# EAGLE board snc98_Display_15x7-Seg_1-digit_SC39 (EAGLE 6.6.0), part 1 of 3
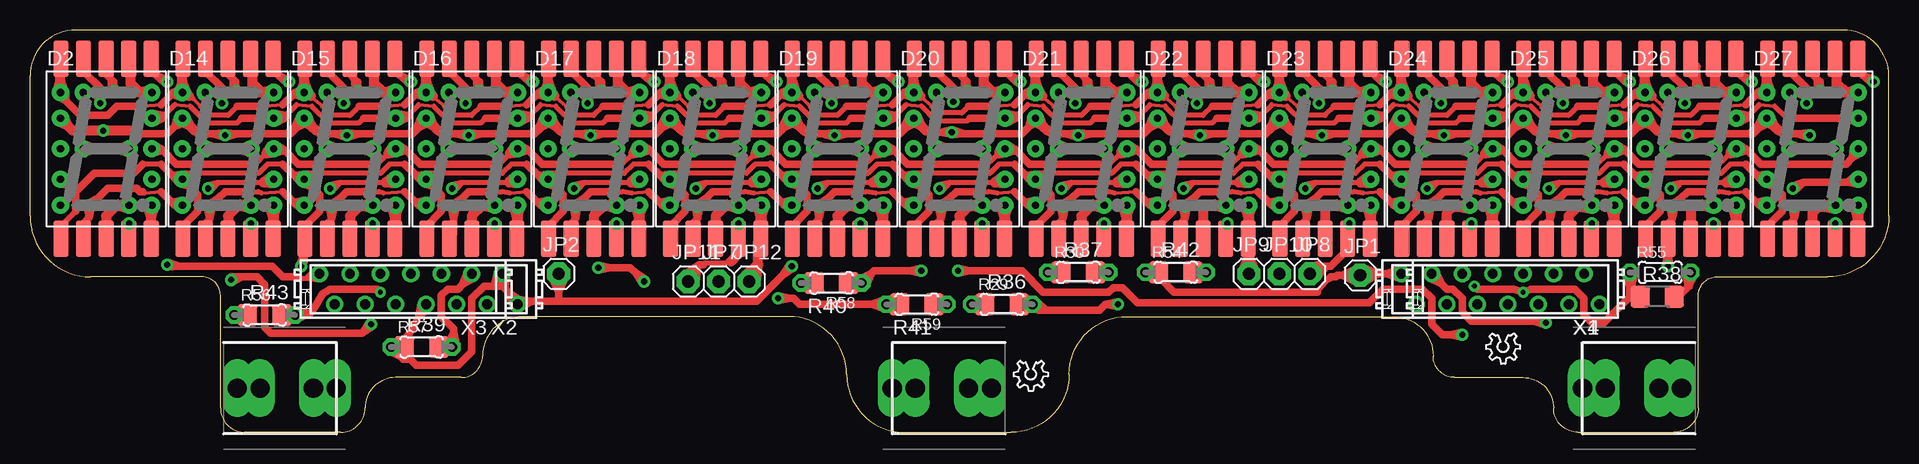
[diagram p2: board, top side]
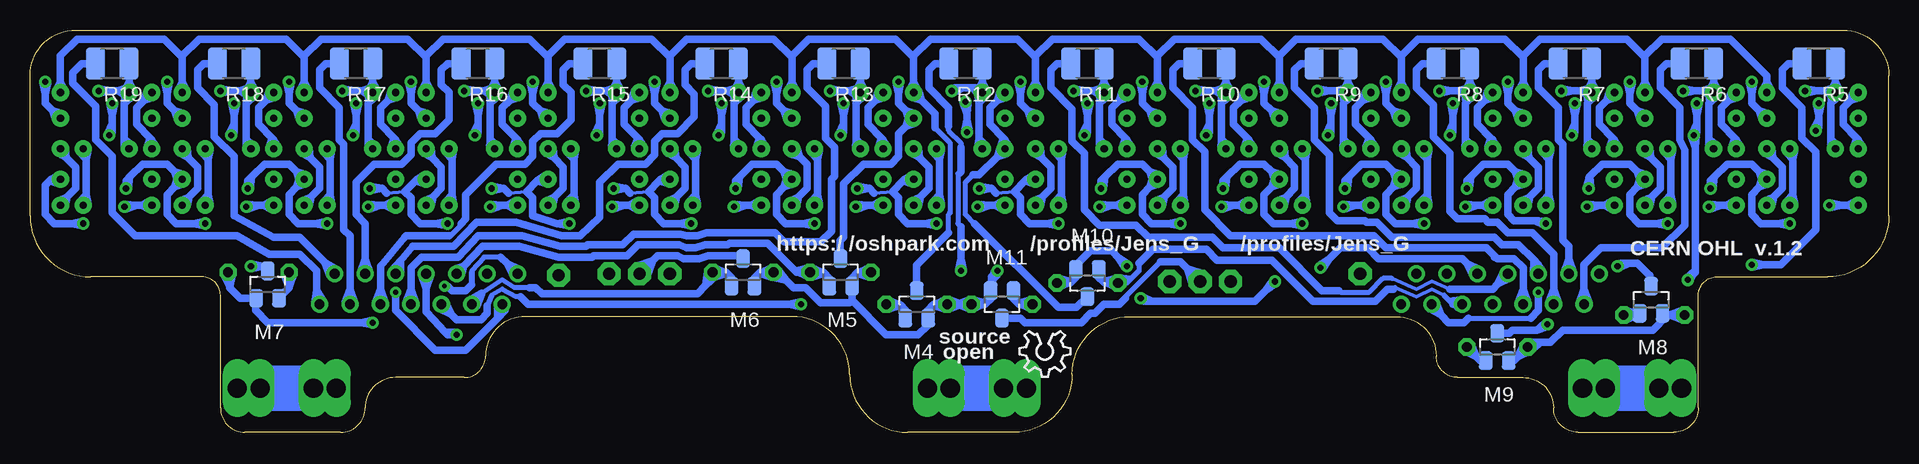
[diagram p3: board, bottom side, seen from below]

Size 154.94 x 33.53 mm. Coordinates in mm from the lower left corner, seen from the top.
Outline: 154.94,29.72 arc90 151.13,33.53 3.81,33.53 arc90 0,29.72 0,18.03 arc90 5.08,12.95 14.35,12.95 arc-90 15.88,11.43 15.88,2.03 arc90 17.91,0 25.91,0 arc90 27.94,2.03 arc-90 30.48,4.57 35.94,4.57 arc90 37.72,6.35 arc-90 41.02,9.65 63.25,9.65 arc-90 68.07,4.83 arc90 72.9,0 81.79,0 arc90 86.61,4.83 arc-90 91.44,9.65 113.67,9.65 arc-90 116.97,6.35 arc90 118.75,4.57 124.46,4.57 arc-90 127,2.03 arc90 129.03,0 137.03,0 arc90 139.06,2.03 139.06,11.43 arc-90 140.59,12.95 149.86,12.95 arc90 154.94,18.03 154.94,29.72
Copper layers (1*16): Top 0.035mm / dielectric 1.5mm / Bottom 0.035mm
Design rules "OSHPark-8mil-2layer": minimum track width 10mil, minimum drill 15mil, track to track 8mil, track to pad 8mil, pad to pad 8mil, via to via 8mil, smd to smd 8mil, copper to edge 8mil, drill to drill 8mil, minimum pad ring 12mil, minimum via ring 10mil, stop-mask expansion 4mil, vias tented up to drill 20mil, thermal gap 10mil

## Footprints (pad centres in the part's own frame; a part is rotated, then mirrored left to right if it is on the bottom)
BATTERY-AAA-LEFT = drill 1.6 long: P1 -2.413,0; P2 3.937,0; P3 2.032,0; P4 -4.318,0
BATTERY-AAA-RIGHT = drill 1.6 long: M1 -3.937,0; M2 2.413,0; M3 4.318,0; M4 -2.032,0
10MM_UNI = drill 0.6 pad 1.422: 1 -3.81,4.699; 2 -3.81,2.54; 3 -3.81,0; 4 -3.81,-2.54; 5 -3.81,-4.699; 6 3.81,-4.699; 7 3.81,-2.54; 8 3.81,0; 9 3.81,2.54; 10 3.81,4.699; 11 -1.905,4.699; 12 -1.905,0; 13 1.905,0; 14 1.905,-4.699 | smd 1.27 x 3.048: 21 -3.76,-7.5; 22 -1.88,-7.5; 23 0,-7.5; 24 1.88,-7.5; 25 3.76,-7.5; 26 3.76,7.5; 27 1.88,7.5; 28 0,7.5; 29 -1.88,7.5; 30 -3.76,7.5
1X01 = drill 1.016 pad 1.93 octagon: 1 0,0
SOT-23 = smd 1.143 x 1.524: 1 0.953,1.143; 2 -0.953,1.143; 3 0,-1.143
R1210 = smd 1.6 x 2.7: 1 -1.4,0; 2 1.4,0
0204/5 = drill 0.813 octagon: 1 -2.54,0; 2 2.54,0
R1206 = smd 1.6 x 1.803: 1 -1.422,0; 2 1.422,0
MICROMATCH-12 = drill 0.813: 1 6.985,-1.27; 2 5.715,1.27; 3 4.445,-1.27; 4 3.175,1.27; 5 1.905,-1.27; 6 0.635,1.27; 7 -0.635,-1.27; 8 -1.905,1.27; 9 -3.175,-1.27; 10 -4.445,1.27; 11 -5.715,-1.27; 12 -6.985,1.27
MICROMATCH-14 = drill 0.813: 1 8.255,-1.27; 2 6.985,1.27; 3 5.715,-1.27; 4 4.445,1.27; 5 3.175,-1.27; 6 1.905,1.27; 7 0.635,-1.27; 8 -0.635,1.27; 9 -1.905,-1.27; 10 -3.175,1.27; 11 -4.445,-1.27; 12 -5.715,1.27; 13 -6.985,-1.27; 14 -8.255,1.27

## Placement (x,y rotation side)
BH4  HOLDER_AAA_LEFT1  [BATTERY-AAA-LEFT]  133.73,3.68 0 top
BH5  HOLDER_AAA_LEFT1  [BATTERY-AAA-LEFT]  76.2,3.68 0 top
BH6  HOLDER_AAA_RIGHT  [BATTERY-AAA-RIGHT]  21.21,3.68 0 top
D2  SC40-11_UNISC40-11_UNI  [10MM_UNI]  6.35,23.62 0 top
D14  SC40-11_UNISC40-11_UNI  [10MM_UNI]  16.51,23.62 0 top
D15  SC40-11_UNISC40-11_UNI  [10MM_UNI]  26.67,23.62 0 top
D16  SC40-11_UNISC40-11_UNI  [10MM_UNI]  36.83,23.62 0 top
D17  SC40-11_UNISC40-11_UNI  [10MM_UNI]  46.99,23.62 0 top
D18  SC40-11_UNISC40-11_UNI  [10MM_UNI]  57.15,23.62 0 top
D19  SC40-11_UNISC40-11_UNI  [10MM_UNI]  67.31,23.62 0 top
D20  SC40-11_UNISC40-11_UNI  [10MM_UNI]  77.47,23.62 0 top
D21  SC40-11_UNISC40-11_UNI  [10MM_UNI]  87.63,23.62 0 top
D22  SC40-11_UNISC40-11_UNI  [10MM_UNI]  97.79,23.62 0 top
D23  SC40-11_UNISC40-11_UNI  [10MM_UNI]  107.95,23.62 0 top
D24  SC40-11_UNISC40-11_UNI  [10MM_UNI]  118.11,23.62 0 top
D25  SC40-11_UNISC40-11_UNI  [10MM_UNI]  128.27,23.62 0 top
D26  SC40-11_UNISC40-11_UNI  [10MM_UNI]  138.43,23.62 0 top
D27  SC40-11_UNISC40-11_UNI  [10MM_UNI]  148.59,23.62 0 top
JP1  [1X01]  110.87,13.08 0 top
JP2  [1X01]  44.07,13.21 0 top
JP7  [1X01]  57.4,12.57 0 top
JP8  [1X01]  106.68,13.21 0 top
JP9  [1X01]  101.6,13.21 0 top
JP10  [1X01]  104.14,13.21 0 top
JP11  [1X01]  54.86,12.57 0 top
JP12  [1X01]  59.94,12.57 0 top
LOGO1  OSHW_LOGO_8MILX0150-NT  [OSHW_8X150_NOTEXT]  68.22,8.43 180 bottom
LOGO2  OSHW_LOGO_6MILX0100-NT  [OSHW_6X100_NOTEXT]  84.84,5.97 180 top
LOGO3  OSHW_LOGO_6MILX0100-NT  [OSHW_6X100_NOTEXT]  124.21,8.26 180 top
M4  IRLML2244  [SOT-23]  81.03,10.67 180 bottom
M5  IRLML2244  [SOT-23]  87.38,13.34 180 bottom
M6  IRLML2244  [SOT-23]  95.5,13.34 180 bottom
M7  IRLML2244  [SOT-23]  135.13,12.32 180 bottom
M8  IRLML2244  [SOT-23]  19.81,11.05 180 bottom
M9  IRLML2244  [SOT-23]  32.64,7.11 180 bottom
M10  IRLML2244  [SOT-23]  66.8,12.45 0 bottom
M11  IRLML2244  [SOT-23]  73.91,10.67 0 bottom
R5  22  [R1210]  5.84,30.73 180 bottom
R6  22  [R1210]  16,30.73 180 bottom
R7  22  [R1210]  26.16,30.73 180 bottom
R8  22  [R1210]  36.32,30.73 180 bottom
R9  22  [R1210]  46.48,30.73 180 bottom
R10  22  [R1210]  56.64,30.73 180 bottom
R11  22  [R1210]  66.8,30.73 180 bottom
R12  22  [R1210]  76.96,30.73 180 bottom
R13  22  [R1210]  87.12,30.73 180 bottom
R14  22  [R1210]  97.28,30.73 180 bottom
R15  22  [R1210]  107.44,30.73 180 bottom
R16  22  [R1210]  117.6,30.73 180 bottom
R17  22  [R1210]  127.76,30.73 180 bottom
R18  22  [R1210]  137.92,30.73 180 bottom
R19  22  [R1210]  148.08,30.73 180 bottom
R29  3k3  [0204/5]  81.03,10.67 0 top
R30  3k3  [0204/5]  87.38,13.34 0 top
R36  3k3  [R1206]  81.03,10.67 0 top
R37  3k3  [R1206]  87.38,13.34 0 top
R38  3k3  [R1206]  135.64,11.3 0 top
R39  3k3  [R1206]  32.64,7.11 0 top
R40  3k3  [R1206]  66.8,12.45 180 top
R41  3k3  [R1206]  73.91,10.67 180 top
R42  3k3  [R1206]  95.5,13.34 0 top
R43  3k3  [R1206]  19.56,9.78 0 top
R54  3k3  [0204/5]  95.5,13.34 0 top
R55  3k3  [0204/5]  135.89,13.34 0 top
R56  3k3  [0204/5]  19.56,9.78 0 top
R57  3k3  [0204/5]  32.64,7.11 0 top
R58  3k3  [0204/5]  66.8,12.45 180 top
R59  3k3  [0204/5]  73.91,10.67 180 top
X1  MICROMATCH-12  [MICROMATCH-12]  123.83,11.94 180 top
X2  MICROMATCH-14  [MICROMATCH-14]  32.38,11.94 180 top
X3  MICROMATCH-12  [MICROMATCH-12]  31.11,11.94 180 top
X4  MICROMATCH-14  [MICROMATCH-14]  122.56,11.94 180 top

## Tracks (layer width: path | path; a pad name or v marks a point on that pad's centre or on a via)
CA_LED  (via drill 0.41, 0.51)
  Top 0.254: 31.92,8.79 31.75,8.89 31.75,7.62 31.32,7.21 R39.1
  Top 0.406: 36.2,6.22 36.2,6.1 | 108.33,12.83 107.31,11.81 107.31,11.68
  Top 0.508: 31.32,7.21 30.24,7.55 R57.1 30.3,6.7 31.32,7.21
  Top 0.61: R43.1 R56.1 | 43.81,10.92 60.58,10.92 62.78,13.12 | 43.81,10.92 42.67,10.92 | 42.67,10.92 41.83,10.92 | 41.83,10.92 40.64,10.92 | 62.78,13.12 v63.5,13.84 | R36.1 R29.1 | R37.1 85.95,13.36 85.85,13.46 84.96,13.46 R30.1 | R54.1 93.7,13.31 R42.1 94.18,13.24 | 107.31,11.68 95.36,11.68 94.25,12.79 94.25,13.17 94.18,13.24 | 40.64,10.92 39.91,11.65 | 39.91,11.65 39.56,12 | 39.56,12 39.37,12.19 | 39.37,12.19 38.7,12.19 | 38.7,12.19 37.85,12.19 36.83,11.18 36.83,6.73 36.2,6.1 35.69,5.59 32.21,5.59 31.7,6.1 31.11,6.1 30.96,6.25 | X2.8 32.41,9.62 | 32.41,9.62 31.92,8.79 31.24,7.62 31.24,7.54 | 31.24,7.54 31.24,7.14 | X4.1 113.08,13.21 | 113.08,13.21 112.39,13.21 | 112.39,13.21 110.24,13.21 JP1.1 | JP1.1 109.35,13.08 | 109.35,13.08 108.97,13.08 108.84,12.95 108.46,12.95 108.33,12.83 | X2.13 39.37,12.19 | 42.55,10.79 42.67,10.92 | JP2.1 44.07,11.68 | 44.07,11.68 44.07,11.18 43.81,10.92 | R58.1 R40.1 | R58.1 68.76,12.45 | 31.7,6.63 31.31,7.01 | 31.31,7.01 R39.1 | 31.11,7.21 R39.1 | R41.1 R59.1 | v74.3,13.46 73.28,13.46 | 73.28,13.46 70.36,13.46 70.2,13.31 | 70.2,13.31 R58.1 | R39.1 R57.1 | 30.96,6.25 R57.1 | R38.1 134.21,11.33 133.48,12.06 133.48,12.12 | 133.48,12.12 133.48,13.21 R55.1 | R55.1 133.35,12.12 | 133.35,12.12 133.35,11.3 131.19,9.14 130.18,9.14 129.54,9.78 129.54,11.18 128.78,11.94 125.09,11.94 v124.46,11.68 123.7,11.94 120.65,11.94 v120.4,12.19 | X2.14 40.64,10.92 | 62.78,13.12 63.61,13.67 v63.5,13.84 | 62.78,13.12 63.33,13.96 v63.5,13.84 | 73.28,13.46 74.25,13.26 v74.3,13.46 | 73.28,13.46 74.25,13.66 v74.3,13.46 | 94.18,13.24 93.13,13.71 R54.1 | 94.18,13.24 93.07,12.94 R54.1 | 133.48,12.12 133.75,13.24 R55.1 | 133.48,12.12 132.98,13.16 R55.1
  Top 0.61: 133.35,12.12 133.73,13.2 R55.1 | 133.35,12.12 132.97,13.2 R55.1 | 32.41,9.62 33.28,10.36 X2.8 | 32.41,9.62 32.62,10.74 X2.8 | 113.08,13.21 114.17,12.82 X4.1 | 113.08,13.21 114.17,13.59 X4.1 | 41.83,10.92 40.69,11.07 X2.14 | 41.83,10.92 40.85,10.32 X2.14 | 39.91,11.65 40.25,10.55 X2.14 | 39.91,11.65 40.87,11.01 X2.14 | 39.56,12 39.77,13.13 X2.13 | 39.56,12 39.01,13.02 X2.13 | 38.7,12.19 39.61,12.88 X2.13 | 38.7,12.19 38.98,13.31 X2.13 | 112.39,13.21 111.11,13.7 JP1.1 | 112.39,13.21 111.21,12.51 JP1.1 | 109.35,13.08 110.58,12.49 JP1.1 | 109.35,13.08 110.58,13.68 JP1.1 | 44.07,11.68 44.66,12.92 JP2.1 | 44.07,11.68 43.47,12.92 JP2.1 | 31.24,7.54 30.09,7.52 R57.1 | 31.24,7.54 30.36,6.8 R57.1 | 31.31,7.01 30.27,7.48 R57.1 | 31.31,7.01 30.2,6.72 R57.1 | 30.96,6.25 30.47,7.29 R57.1 | 30.96,6.25 29.92,6.75 R57.1 | 70.2,13.31 69.17,12.81 R58.1 | 70.2,13.31 69.71,12.27 R58.1
  Bottom 0.406: 118.11,13.34 118.11,13.46 117.09,14.61 115.7,14.61
  Bottom 0.508: 118.11,13.34 118.11,12.32
  Bottom 0.61: 28.94,7.49 28.19,7.49 27.18,8.51 19.68,8.51 18.49,9.7 M8.2 18.75,9.78 18.24,9.78 | 28.94,7.49 29.72,7.49 R57.1 | 64.22,14.56 64.77,15.11 66.55,15.11 67.74,13.92 M10.2 67.74,12.93 68.13,12.54 | 64.22,14.56 v63.5,13.84 | 18.24,9.78 R56.1 | 79.7,10.57 80.09,10.19 M4.2 80.14,9.6 80.14,8.89 80.9,8.13 83.57,8.13 86.44,11 | 79.7,10.57 R36.1 R29.1 | 86.05,13.24 86.44,12.85 M5.2 86.44,12.31 86.44,11 | 86.05,13.24 R37.1 R30.1 | 86.44,11 86.64,10.79 89.03,10.79 90.3,12.06 91.31,12.06 91.93,12.69 | R54.1 92.58,13.34 91.93,12.69 | v120.4,12.19 120.14,12.19 119.76,11.81 118.62,11.81 118.11,12.32 | R58.1 68.33,12.45 | M9.2 31.24,5.97 30.96,6.25 | 30.96,6.25 R57.1 | 68.13,12.54 R40.1 R58.1 | 75.24,10.77 74.85,11.15 M11.2 74.8,11.73 74.8,12.58 | 75.24,10.77 R41.1 R59.1 | 74.8,12.58 74.8,12.95 v74.3,13.46 | R59.1 77.27,10.67 | 77.27,10.67 77.67,10.67 | 77.67,10.67 R29.1 | X4.2 115.32,10.16 115.96,9.51 | M7.2 R38.1 134.21,11.33 133.6,11.81 | 133.6,11.81 133.35,12.06 133.35,12.12 | 133.35,12.12 R55.1 | 133.6,11.81 134.11,11.3 134.24,11.3 | 115.96,9.51 118.62,6.86 121.16,6.86 124.46,10.16 v124.46,11.68 | M6.2 94.55,12.87 94.18,13.24 | 94.18,13.24 R42.1 R54.1 | X4.1 115.16,14.07 | 115.16,14.07 115.7,14.61 | 64.22,14.56 63.39,14.01 v63.5,13.84 | 64.22,14.56 63.67,13.73 v63.5,13.84 | 74.8,12.58 74.49,13.53 v74.3,13.46 | 74.8,12.58 74.14,13.33 v74.3,13.46 | 79.7,10.57 78.65,11.04 R29.1 | 79.7,10.57 78.59,10.28 R29.1 | 77.27,10.67 78.35,10.29 R29.1 | 77.27,10.67 78.35,11.05 R29.1 | 86.05,13.24 85,13.71 R30.1 | 86.05,13.24 84.94,12.94 R30.1 | 91.93,12.69 93.05,12.94 R54.1 | 91.93,12.69 92.64,13.59 R54.1 | 94.18,13.24 93.13,13.71 R54.1
  Bottom 0.61: 94.18,13.24 93.07,12.94 R54.1 | 133.35,12.12 133.73,13.2 R55.1 | 133.35,12.12 132.97,13.2 R55.1 | 18.24,9.78 17.15,10.16 R56.1 | 18.24,9.78 17.15,9.4 R56.1 | 115.16,14.07 114.12,13.57 X4.1 | 115.16,14.07 114.67,13.03 X4.1 | 115.96,9.51 115.98,10.66 X4.2 | 115.96,9.51 115.25,10.42 X4.2 | 28.94,7.49 29.85,6.79 R57.1 | 28.94,7.49 30.09,7.52 R57.1 | 30.96,6.25 30.47,7.29 R57.1 | 30.96,6.25 29.92,6.75 R57.1 | 68.13,12.54 69.18,12.07 R58.1 | 68.13,12.54 69.24,12.84 R58.1 | 75.24,10.77 76.29,10.3 R59.1 | 75.24,10.77 76.35,11.06 R59.1 | 77.67,10.67 76.59,11.05 R59.1 | 77.67,10.67 76.59,10.29 R59.1
D0_A  (via drill 0.51)
  Top 0.406: 22.1,12.95 22.23,12.95 22.35,12.83 22.97,12.83 | 22.97,12.83 23.88,12.83 24,12.95 | 22.97,12.83 24.07,12.7 X2.1 23.79,13.58 22.97,12.83
  Top 0.61: 12.44,13.84 20.19,13.84 21.08,12.95 22.1,12.95 | 12.44,13.84 11.56,13.84 v11.43,13.97 | X2.1 24.26,13.21 24,12.95 | 12.44,13.84 11.49,14.16 v11.43,13.97 | 12.44,13.84 11.45,13.77 v11.43,13.97
  Bottom 0.61: v11.43,13.97 10.41,13.97 | 10.41,13.97 9.02,13.97 6.1,16.89 6.1,23.37 7.24,24.51 7.24,27.05 8.89,28.7 8.89,30.23 8.38,30.73 R5.2 | 10.41,13.97 11.39,13.77 v11.43,13.97 | 10.41,13.97 11.39,14.17 v11.43,13.97
D1_A
  Bottom 0.61: R6.2 18.54,30.73 19.05,30.23 19.05,28.7 17.4,27.05 17.4,24.38 17.02,23.5 17.02,17.27 18.92,15.37 24,15.37 25.4,13.97 25.4,11.89 | 25.4,11.89 X2.2 | 25.4,11.89 25.02,10.8 X2.2 | 25.4,11.89 25.78,10.8 X2.2
D2_A
  Bottom 0.61: X2.3 26.67,14.43 | 26.67,14.43 26.67,15.49 27.18,16 27.18,24 27.56,24.38 27.56,27.05 29.21,28.7 29.21,30.23 28.7,30.73 R7.2 | 26.67,14.43 26.29,13.34 X2.3 | 26.67,14.43 27.05,13.34 X2.3
D3_A
  Bottom 0.61: R8.2 38.86,30.73 39.37,30.23 39.37,28.7 37.97,27.3 37.97,24.64 36.58,23.24 36.58,18.41 35.94,17.78 33.66,17.78 33.4,17.53 32.64,17.53 31.75,16.64 29.72,16.64 27.94,14.86 27.94,11.89 | 27.94,11.89 X2.4 | 27.94,11.89 27.56,10.8 X2.4 | 27.94,11.89 28.32,10.8 X2.4
D4_A
  Bottom 0.61: 29.6,14.36 29.21,13.97 X2.5 | 29.6,14.36 30.86,15.62 32.26,15.62 32.89,16.26 41.4,16.26 42.67,17.53 43.56,17.53 43.69,17.65 45.97,17.65 46.61,18.29 46.61,23.11 47.88,24.38 47.88,27.05 49.53,28.7 49.53,30.23 49.02,30.73 R9.2 | 29.6,14.36 28.89,13.46 X2.5 | 29.6,14.36 29.62,13.21 X2.5
D5_A
  Bottom 0.61: R10.2 59.18,30.73 59.69,30.23 59.69,28.7 58.04,27.05 58.04,24.38 57.02,23.37 57.02,18.54 54.86,16.38 42.93,16.38 41.91,15.37 33.53,15.37 32.77,14.61 | 32.89,14.61 32.77,14.61 | 30.48,11.89 30.48,13.72 31.24,14.48 32.64,14.48 32.77,14.61 | 30.48,11.89 X2.6 | 30.48,11.89 30.1,10.8 X2.6 | 30.48,11.89 30.86,10.8 X2.6
D6_A
  Bottom 0.305: 36.58,11.94 38.1,12.57 39.37,11.94 41.4,12.83
  Bottom 0.406: 41.4,12.83 42.16,12.83 43.31,11.68 45.72,11.68 45.85,11.81
  Bottom 0.61: 45.85,11.81 47.24,11.81 50.8,15.37 55.5,15.37 56.39,16.26 61.72,16.26 62.74,17.27 65.79,17.27 67.06,18.54 67.06,23.24 68.07,24.26 68.07,26.92 69.85,28.7 69.85,30.23 69.34,30.73 R11.2 | 36.58,11.94 33.02,11.94 32.61,12.35 | 32.61,12.35 X2.7 | 32.61,12.35 32.12,13.38 X2.7 | 32.61,12.35 31.57,12.84 X2.7
D7_A  (via drill 0.51)
  Top 0.61: v77.34,13.46 78.36,13.46 | 78.36,13.46 82.68,13.46 84.45,11.68 89.92,11.68 90.3,12.06 91.06,12.06 92.33,10.79 111.63,10.79 112.78,11.94 116.08,11.94 116.84,11.18 116.84,9.02 117.73,8.13 118.36,8.13 | v119.38,8.13 118.36,8.13 | 78.36,13.46 77.38,13.66 v77.34,13.46 | 78.36,13.46 77.38,13.26 v77.34,13.46 | 118.36,8.13 119.34,7.93 v119.38,8.13 | 118.36,8.13 119.34,8.33 v119.38,8.13
  Bottom 0.406: 77.34,21.72 77.34,21.59 77.47,21.46 77.6,21.59 77.6,17.4 77.34,17.14 | 77.34,23.75 77.34,24.13 78.36,25.15 78.36,25.52
  Bottom 0.61: 77.34,17.14 77.34,14.48 | 77.34,14.48 v77.34,13.46 | R12.2 79.5,30.73 80.01,30.23 80.01,28.7 78.36,27.05 78.36,25.53 78.36,25.52 | 77.34,21.72 77.34,23.75 | 120.36,8.38 121.28,9.4 121.92,10.03 121.92,11.99 | 120.36,8.38 120.14,8.13 v119.38,8.13 | X4.7 121.92,11.99 | 77.34,14.48 77.14,13.5 v77.34,13.46 | 77.34,14.48 77.54,13.5 v77.34,13.46 | 120.36,8.38 119.37,8.33 v119.38,8.13 | 120.36,8.38 119.47,7.95 v119.38,8.13 | 121.92,11.99 122.3,13.07 X4.7 | 121.92,11.99 121.54,13.07 X4.7
D8_A
  Bottom 0.61: R13.2 89.66,30.73 90.17,30.23 90.17,28.7 88.65,27.18 88.65,24.51 87.88,23.75 87.88,21.34 88.14,21.08 88.14,16.76 89.03,15.88 92.08,15.88 92.84,16.64 98.55,16.64 99.31,16.38 100.2,16.38 100.71,16.51 104.65,16.51 105.54,15.62 108.46,15.62 108.58,15.49 110.74,15.49 113.92,16.38 117.6,16.38 119.25,14.61 122.3,14.61 123.19,13.72 123.19,11.89 | 123.19,11.89 X4.8 | 123.19,11.89 122.81,10.8 X4.8 | 123.19,11.89 123.57,10.8 X4.8
D9_A
  Bottom 0.61: 124.05,14.3 124.21,13.97 X4.9 | 124.05,14.3 123.06,15.49 119.63,15.49 117.73,17.53 114.43,17.53 110.62,16.38 109.09,16.38 107.44,17.91 107.44,20.83 105.92,22.35 103.63,22.35 102.87,23.11 102.87,24.26 102.23,24.89 100.97,24.89 99.57,26.29 99.57,28.19 100.33,28.96 100.33,30.23 99.82,30.73 R14.2 | 124.05,14.3 124.06,13.16 X4.9 | 124.05,14.3 124.75,13.5 X4.9
D10_A
  Bottom 0.406: 120.02,16.38 119.89,16.38 119,17.27 119,17.4
  Bottom 0.61: 119,17.4 118.62,17.78 118.62,19.81 116.08,22.35 113.67,22.35 113.03,22.99 113.03,24.26 112.39,24.89 111,24.89 109.86,26.04 109.86,28.32 110.49,28.96 110.49,30.23 109.98,30.73 R15.2 | X4.10 125.73,11.89 | 125.73,11.89 125.73,13.84 123.7,16.26 123.57,16.38 120.02,16.38 | 125.73,11.89 125.35,10.8 X4.10 | 125.73,11.89 126.11,10.8 X4.10
D11_A
  Bottom 0.61: R16.2 120.14,30.73 120.65,30.23 120.65,28.96 120.02,28.32 120.02,26.04 121.16,24.89 122.43,24.89 123.19,24.13 123.19,23.11 123.95,22.35 126.24,22.35 127.76,20.83 127.76,18.16 127,17.4 127,14.43 | X4.11 127,14.43 | 127,14.43 126.62,13.34 X4.11 | 127,14.43 127.38,13.34 X4.11
D12_A
  Bottom 0.61: 129.29,30.61 R17.2 130.3,30.73 130.81,30.23 130.81,28.7 129.16,27.05 129.16,24.38 128.78,24 128.78,16.89 128.27,16.38 128.27,11.89 | X4.12 128.27,11.89 | 128.27,11.89 127.89,10.8 X4.12 | 128.27,11.89 128.65,10.8 X4.12
D13_A
  Bottom 0.61: R18.2 140.46,30.73 140.97,30.23 140.97,28.7 139.57,27.3 139.57,24.64 137.92,22.99 137.92,18.03 134.62,16.26 132.46,16.26 130.34,14.13 | X4.13 129.41,13.21 130.34,14.13 | 130.34,14.13 129.34,13.56 X4.13 | 130.34,14.13 129.92,13.06 X4.13
D14_A
  Bottom 0.61: 149.73,30.48 R19.2 150.62,30.73 151.38,29.97 151.38,29.08 149.48,27.18 149.48,24.38 148.08,22.99 148.08,18.29 146.18,16.38 137.67,16.38 135,14.86 132.46,14.86 131.06,13.46 131.06,11.86 | 131.06,11.86 131.06,10.92 X4.14 | 131.06,11.86 130.46,10.88 X4.14 | 131.06,11.86 131.21,10.72 X4.14
DIG_0  (via drill 0.51)
  Top 0.61: D2.28 6.35,29.84 6.76,29.44 | 6.76,29.44 6.99,29.21 v6.99,28.45 | 6.76,29.44 6.78,28.44 v6.99,28.45 | 6.76,29.44 7.17,28.53 v6.99,28.45
  Top 0.813: D2.14 7.36,18.92 | 7.36,18.92 7.24,18.92 6.35,18.03 D2.23 | D2.13 7.36,23.62 | 7.36,23.62 5.34,23.62 | 5.34,23.62 D2.12 | 5.34,23.62 4.55,23.91 D2.12 | 5.34,23.62 4.55,23.34 D2.12 | 7.36,23.62 8.15,23.34 D2.13 | 7.36,23.62 8.15,23.91 D2.13 | 7.36,18.92 8.15,18.64 D2.14 | 7.36,18.92 8.15,19.21 D2.14
  Bottom 0.61: D2.11 4.45,27.81 4.78,27.48 | 4.78,27.48 4.83,27.43 4.83,24.44 | 4.83,24.44 4.83,24 D2.12 | v6.99,28.45 5.97,28.45 | 5.97,28.45 5.34,28.45 | 5.34,28.45 4.7,28.45 4.45,28.7 | R5.1 4.44,30.48 4.45,30.48 4.45,29.22 | 8.26,23.5 8,23.24 8,22.76 | 8,22.76 8,19.79 | 8,19.79 8,19.18 D2.14 | 4.45,29.22 D2.11 | 5.97,28.45 6.94,28.25 v6.99,28.45 | 5.97,28.45 6.94,28.65 v6.99,28.45 | 4.83,24.44 4.19,23.94 D2.12 | 4.83,24.44 4.85,23.64 D2.12 | 4.78,27.48 4.85,28.28 D2.11 | 4.78,27.48 4.17,28.02 D2.11 | 5.34,28.45 4.58,28.71 D2.11 | 5.34,28.45 4.68,27.99 D2.11 | 4.45,29.22 4.08,28.5 D2.11 | 4.45,29.22 4.81,28.5 D2.11 | 8,22.76 8.55,23.34 D2.13 7.86,23.55 8,22.76 | 8,19.79 7.86,19 D2.14 | 8,19.79 8.55,19.2 D2.14
  Bottom 0.813: D2.11 4.45,28.7 | D2.13 8.26,23.5
DIG_1  (via drill 0.51)
  Top 0.406: 16.13,29.84 16.51,29.84 D14.28
  Top 0.61: 16.51,29.84 16.92,29.44 | 16.92,29.44 17.14,29.21 v17.14,28.45 | 16.92,29.44 16.94,28.44 v17.14,28.45 | 16.92,29.44 17.33,28.53 v17.14,28.45
  Top 0.813: D14.23 16.51,18.03 17.4,18.92 17.52,18.92 | D14.14 17.52,18.92 | D14.13 17.52,23.62 | 17.52,23.62 15.51,23.62 | 15.51,23.62 D14.12 | 15.51,23.62 14.71,23.91 D14.12 | 15.51,23.62 14.71,23.34 D14.12 | 17.52,23.62 18.31,23.34 D14.13 | 17.52,23.62 18.31,23.91 D14.13 | 17.52,18.92 18.31,18.64 D14.14 | 17.52,18.92 18.31,19.21 D14.14
  Bottom 0.305: R6.1 14.6,30.48 14.61,30.48
  Bottom 0.61: D14.11 14.61,27.81 14.94,27.48 | 14.94,27.48 14.99,27.43 14.99,24.44 | 14.99,24.44 14.99,24 D14.12 | 14.61,28.7 14.86,28.45 15.5,28.45 | 14.61,30.48 14.61,29.22 | 14.61,29.22 D14.11 | v17.14,28.45 16.13,28.45 | 16.13,28.45 15.5,28.45 | 18.41,23.5 18.16,23.24 18.16,22.76 | 18.16,22.76 18.16,19.79 | 18.16,19.79 18.16,19.18 D14.14 | 16.13,28.45 17.1,28.25 v17.14,28.45 | 16.13,28.45 17.1,28.65 v17.14,28.45 | 14.99,24.44 14.35,23.94 D14.12 | 14.99,24.44 15.01,23.64 D14.12 | 14.94,27.48 15.01,28.28 D14.11 | 14.94,27.48 14.34,28.02 D14.11 | 14.61,29.22 14.24,28.5 D14.11 | 14.61,29.22 14.97,28.5 D14.11 | 15.5,28.45 14.74,28.71 D14.11 | 15.5,28.45 14.84,27.99 D14.11 | 18.16,22.76 18.71,23.34 D14.13 18.02,23.55 18.16,22.76 | 18.16,19.79 18.02,19 D14.14 | 18.16,19.79 18.71,19.2 D14.14
  Bottom 0.813: D14.11 14.61,28.7 | D14.13 18.41,23.5
DIG_2  (via drill 0.51)
  Top 0.61: 27.08,29.44 26.67,29.84 D15.28 | 27.08,29.44 27.3,29.21 v27.3,28.45 | 27.08,29.44 27.1,28.44 v27.3,28.45 | 27.08,29.44 27.49,28.53 v27.3,28.45
  Top 0.813: D15.13 27.68,23.62 | 27.68,23.62 25.66,23.62 | 25.66,23.62 D15.12 | D15.23 26.67,18.03 27.56,18.92 27.68,18.92 | D15.14 27.68,18.92 | 25.66,23.62 24.87,23.91 D15.12 | 25.66,23.62 24.87,23.34 D15.12 | 27.68,23.62 28.47,23.34 D15.13 | 27.68,23.62 28.47,23.91 D15.13 | 27.68,18.92 28.47,18.64 D15.14 | 27.68,18.92 28.47,19.21 D15.14
  Bottom 0.305: R7.1 24.76,30.48 24.77,30.48
  Bottom 0.61: D15.11 24.77,27.81 25.09,27.48 | 25.09,27.48 25.15,27.43 25.15,24.44 | 25.15,24.44 25.15,24 D15.12 | 24.77,28.7 25.02,28.45 25.66,28.45 | 24.77,30.48 24.77,29.22 | 24.77,29.22 D15.11 | 28.57,23.5 28.32,23.24 28.32,22.76 | v27.3,28.45 26.29,28.45 | 26.29,28.45 25.66,28.45 | 28.32,22.76 28.32,19.79 | 28.32,19.79 28.32,19.18 D15.14 | 26.29,28.45 27.26,28.25 v27.3,28.45 | 26.29,28.45 27.26,28.65 v27.3,28.45 | 25.15,24.44 24.51,23.94 D15.12 | 25.15,24.44 25.17,23.64 D15.12 | 25.09,27.48 25.17,28.28 D15.11 | 25.09,27.48 24.5,28.02 D15.11 | 24.77,29.22 24.4,28.5 D15.11 | 24.77,29.22 25.13,28.5 D15.11 | 25.66,28.45 24.9,28.71 D15.11 | 25.66,28.45 25,27.99 D15.11 | 28.32,22.76 28.87,23.34 D15.13 28.18,23.55 28.32,22.76 | 28.32,19.79 28.18,19 D15.14 | 28.32,19.79 28.87,19.2 D15.14
  Bottom 0.813: D15.11 24.77,28.7 | D15.13 28.57,23.5
DIG_3  (via drill 0.51)
  Top 0.61: 37.24,29.44 36.83,29.84 D16.28 | 37.24,29.44 37.47,29.21 v37.47,28.45 | 37.24,29.44 37.26,28.44 v37.47,28.45 | 37.24,29.44 37.65,28.53 v37.47,28.45
  Top 0.813: D16.13 37.84,23.62 | 37.84,23.62 35.83,23.62 | 35.83,23.62 D16.12 | D16.23 36.83,18.03 37.72,18.92 37.84,18.92 | D16.14 37.84,18.92 | 35.83,23.62 35.03,23.91 D16.12 | 35.83,23.62 35.03,23.34 D16.12 | 37.84,23.62 38.63,23.34 D16.13 | 37.84,23.62 38.63,23.91 D16.13 | 37.84,18.92 38.63,18.64 D16.14 | 37.84,18.92 38.63,19.21 D16.14
  Bottom 0.61: 38.73,23.5 38.48,23.24 38.48,22.76 | D16.11 34.92,27.81 35.26,27.48 | 35.26,27.48 35.31,27.43 35.31,24.44 | 35.31,24.44 35.31,24 D16.12 | 34.92,28.7 35.18,28.45 35.82,28.45 | 34.92,29.22 R8.1 | 34.92,29.22 D16.11 | 38.48,22.76 38.48,19.79 | 38.48,19.79 38.48,19.18 D16.14 | v37.47,28.45 36.45,28.45 | 36.45,28.45 35.82,28.45 | 36.45,28.45 37.42,28.25 v37.47,28.45 | 36.45,28.45 37.42,28.65 v37.47,28.45 | 35.31,24.44 34.67,23.94 D16.12 | 35.31,24.44 35.33,23.64 D16.12 | 35.26,27.48 35.33,28.28 D16.11 | 35.26,27.48 34.66,28.02 D16.11 | 34.92,29.22 34.56,28.5 D16.11 | 34.92,29.22 35.29,28.5 D16.11 | 35.82,28.45 35.06,28.71 D16.11 | 35.82,28.45 35.16,27.99 D16.11 | 38.48,22.76 39.03,23.34 D16.13 38.34,23.55 38.48,22.76 | 38.48,19.79 38.34,19 D16.14 | 38.48,19.79 39.03,19.2 D16.14
  Bottom 0.813: D16.13 38.73,23.5 | D16.11 34.92,28.7
DIG_4  (via drill 0.51)
  Top 0.61: 46.99,29.84 47.4,29.44 | 47.4,29.44 47.62,29.21 v47.62,28.45 | 47.4,29.44 47.42,28.44 v47.62,28.45 | 47.4,29.44 47.81,28.53 v47.62,28.45
  Top 0.813: D17.23 46.99,18.03 47.88,18.92 47.99,18.92 | D17.13 47.99,23.62 | 47.99,23.62 45.98,23.62 | 45.98,23.62 D17.12 | 46.99,29.84 D17.28 | D17.14 47.99,18.92 | 45.98,23.62 45.19,23.91 D17.12 | 45.98,23.62 45.19,23.34 D17.12 | 47.99,23.62 48.79,23.34 D17.13 | 47.99,23.62 48.79,23.91 D17.13 | 47.99,18.92 48.79,18.64 D17.14 | 47.99,18.92 48.79,19.21 D17.14
  Bottom 0.61: D17.11 45.09,27.81 45.41,27.48 | 45.41,27.48 45.47,27.43 45.47,24.44 | 45.47,24.44 45.47,24 D17.12 | 45.09,28.7 45.34,28.45 45.98,28.45 | 45.09,30.48 45.09,29.22 | 45.09,29.22 D17.11 | 48.9,23.5 48.64,23.24 48.64,22.76 | 48.64,22.76 48.64,19.79 | 48.64,19.79 48.64,19.18 D17.14 | v47.62,28.45 46.61,28.45 | 46.61,28.45 45.98,28.45 | 46.61,28.45 47.58,28.25 v47.62,28.45 | 46.61,28.45 47.58,28.65 v47.62,28.45 | 45.47,24.44 44.83,23.94 D17.12 | 45.47,24.44 45.49,23.64 D17.12 | 45.41,27.48 45.49,28.28 D17.11 | 45.41,27.48 44.81,28.02 D17.11 | 45.09,29.22 44.72,28.5 D17.11 | 45.09,29.22 45.45,28.5 D17.11 | 45.98,28.45 45.22,28.71 D17.11 | 45.98,28.45 45.32,27.99 D17.11 | 48.64,22.76 49.19,23.34 D17.13 48.49,23.55 48.64,22.76 | 48.64,19.79 48.49,19 D17.14 | 48.64,19.79 49.19,19.2 D17.14
  Bottom 0.813: D17.11 45.09,28.7 | D17.13 48.9,23.5 | 45.09,30.48 R9.1
DIG_5  (via drill 0.51)
  Top 0.61: 57.15,29.84 57.56,29.44 | 57.56,29.44 57.78,29.21 v57.78,28.45 | 57.56,29.44 57.58,28.44 v57.78,28.45 | 57.56,29.44 57.97,28.53 v57.78,28.45
  Top 0.813: D18.12 56.15,23.62 | 56.15,23.62 58.16,23.62 | 58.16,23.62 D18.13 | D18.23 57.15,18.03 58.04,18.92 58.16,18.92 | D18.28 57.15,29.84 | D18.14 58.16,18.92 | 56.15,23.62 55.35,23.91 D18.12 | 56.15,23.62 55.35,23.34 D18.12 | 58.16,23.62 58.95,23.34 D18.13 | 58.16,23.62 58.95,23.91 D18.13 | 58.16,18.92 58.95,18.64 D18.14 | 58.16,18.92 58.95,19.21 D18.14
  Bottom 0.61: 59.05,23.5 58.8,23.24 58.8,22.76 | 58.8,22.76 58.8,19.79 | 58.8,19.79 58.8,19.18 D18.14 | D18.11 55.24,27.81 55.58,27.48 | 55.58,27.48 55.63,27.43 55.63,24.44 | 55.63,24.44 55.63,24 D18.12 | 55.24,28.7 55.5,28.45 56.14,28.45 | 55.24,30.48 55.24,29.22 | 55.24,29.22 D18.11 | v57.78,28.45 56.77,28.45 | 56.77,28.45 56.14,28.45 | 56.77,28.45 57.74,28.25 v57.78,28.45 | 56.77,28.45 57.74,28.65 v57.78,28.45 | 55.63,24.44 54.99,23.94 D18.12 | 55.63,24.44 55.65,23.64 D18.12 | 55.58,27.48 55.65,28.28 D18.11 | 55.58,27.48 54.98,28.02 D18.11 | 55.24,29.22 54.88,28.5 D18.11 | 55.24,29.22 55.61,28.5 D18.11 | 56.14,28.45 55.38,28.71 D18.11 | 56.14,28.45 55.48,27.99 D18.11 | 58.8,22.76 59.35,23.34 D18.13 58.66,23.55 58.8,22.76 | 58.8,19.79 58.66,19 D18.14 | 58.8,19.79 59.35,19.2 D18.14
  Bottom 0.813: D18.13 59.05,23.5 | D18.11 55.24,28.7 | 55.24,30.48 R10.1
DIG_6  (via drill 0.51)
  Top 0.61: 67.72,29.44 67.31,29.84 D19.28 | 67.72,29.44 67.94,29.21 v67.94,28.45 | 67.72,29.44 67.74,28.44 v67.94,28.45 | 67.72,29.44 68.13,28.53 v67.94,28.45
  Top 0.813: D19.13 68.31,23.62 | 68.31,23.62 66.31,23.62 | 66.31,23.62 D19.12 | D19.23 67.31,18.03 68.2,18.92 68.31,18.92 | D19.14 68.31,18.92 | 66.31,23.62 65.51,23.91 D19.12 | 66.31,23.62 65.51,23.34 D19.12 | 68.31,23.62 69.11,23.34 D19.13 | 68.31,23.62 69.11,23.91 D19.13 | 68.31,18.92 69.11,18.64 D19.14 | 68.31,18.92 69.11,19.21 D19.14
  Bottom 0.61: D19.11 65.41,27.81 65.73,27.48 | 65.73,27.48 65.79,27.43 65.79,24.44 | 65.79,24.44 65.79,24 D19.12 | v67.94,28.45 66.93,28.45 | 66.93,28.45 66.3,28.45 | 66.3,28.45 65.66,28.45 65.41,28.7 | 65.41,29.22 R11.1 | 65.41,29.22 D19.11 | 69.22,23.5 68.96,23.24 68.96,22.76 | 68.96,22.76 68.96,19.79 | 68.96,19.79 68.96,19.18 D19.14 | 66.93,28.45 67.9,28.25 v67.94,28.45 | 66.93,28.45 67.9,28.65 v67.94,28.45 | 65.79,24.44 65.15,23.94 D19.12 | 65.79,24.44 65.81,23.64 D19.12 | 65.73,27.48 65.81,28.28 D19.11 | 65.73,27.48 65.14,28.02 D19.11 | 66.3,28.45 65.54,28.71 D19.11 | 66.3,28.45 65.64,27.99 D19.11 | 65.41,29.22 65.04,28.5 D19.11 | 65.41,29.22 65.77,28.5 D19.11 | 68.96,22.76 69.51,23.34 D19.13 68.81,23.55 68.96,22.76 | 68.96,19.79 68.81,19 D19.14 | 68.96,19.79 69.51,19.2 D19.14
  Bottom 0.813: D19.11 65.41,28.7 | D19.13 69.22,23.5
DIG_7  (via drill 0.51)
  Top 0.61: 77.88,29.44 77.47,29.84 D20.28 | 77.88,29.44 78.11,29.21 v78.11,28.45 | 77.88,29.44 77.9,28.44 v78.11,28.45 | 77.88,29.44 78.29,28.53 v78.11,28.45
  Top 0.813: D20.13 78.47,23.62 | 78.47,23.62 76.47,23.62 | 76.47,23.62 D20.12 | D20.23 77.47,18.03 78.36,18.92 78.47,18.92 | D20.14 78.47,18.92 | 76.47,23.62 75.67,23.91 D20.12 | 76.47,23.62 75.67,23.34 D20.12 | 78.47,23.62 79.27,23.34 D20.13 | 78.47,23.62 79.27,23.91 D20.13 | 78.47,18.92 79.27,18.64 D20.14 | 78.47,18.92 79.27,19.21 D20.14
  Bottom 0.61: D20.11 75.56,27.81 75.82,27.56 75.82,27.46 | 75.82,27.46 75.82,24.48 | 75.82,24.48 75.82,23.88 D20.12 | 75.56,28.7 75.82,28.45 76.07,28.45 76.33,28.7 76.38,28.7 | 75.56,29.22 R12.1 | 75.56,29.22 D20.11 | 79.38,23.5 79.12,23.24 79.12,22.76 | 79.12,22.76 79.12,19.79 | 79.12,19.79 79.12,19.18 D20.14 | 76.38,28.7 77.12,28.7 | 77.12,28.7 77.85,28.7 v78.11,28.45 | 77.12,28.7 78.02,28.27 v78.11,28.45 | 77.12,28.7 78.11,28.65 v78.11,28.45 | 75.82,24.48 75.27,23.9 D20.12 | 75.82,24.48 75.97,23.7 D20.12 | 75.82,27.46 75.97,28.25 D20.11 | 75.82,27.46 75.27,28.04 D20.11 | 75.56,29.22 75.2,28.5 D20.11 | 75.56,29.22 75.93,28.5 D20.11 | 76.38,28.7 75.58,28.73 D20.11 | 76.38,28.7 75.89,28.07 D20.11 | 79.12,22.76 79.67,23.34 D20.13 78.97,23.55 79.12,22.76 | 79.12,19.79 78.97,19 D20.14 | 79.12,19.79 79.67,19.2 D20.14
  Bottom 0.813: D20.11 75.56,28.7 | D20.13 79.38,23.5
DIG_8  (via drill 0.51)
  Top 0.61: 88.04,29.44 87.63,29.84 D21.28 | 88.04,29.44 88.27,29.21 v88.27,28.45 | 88.04,29.44 88.06,28.44 v88.27,28.45 | 88.04,29.44 88.45,28.53 v88.27,28.45
  Top 0.813: D21.13 88.64,23.62 | 88.64,23.62 86.62,23.62 | 86.62,23.62 D21.12 | D21.23 87.63,18.03 88.52,18.92 88.64,18.92 | D21.14 88.64,18.92 | 86.62,23.62 85.83,23.91 D21.12 | 86.62,23.62 85.83,23.34 D21.12 | 88.64,23.62 89.43,23.34 D21.13 | 88.64,23.62 89.43,23.91 D21.13 | 88.64,18.92 89.43,18.64 D21.14 | 88.64,18.92 89.43,19.21 D21.14
  Bottom 0.61: D21.11 85.72,27.81 86.06,27.48 | 86.06,27.48 86.11,27.43 86.11,24.44 | 86.11,24.44 86.11,24 D21.12 | v88.27,28.45 87.25,28.45 | 87.25,28.45 86.62,28.45 | 86.62,28.45 85.98,28.45 85.72,28.7 | 85.72,29.22 R13.1 | 85.72,29.22 D21.11 | 89.53,23.5 89.28,23.24 89.28,22.76 | 89.28,22.76 89.28,19.79 | 89.28,19.79 89.28,19.18 D21.14 | 87.25,28.45 88.22,28.25 v88.27,28.45 | 87.25,28.45 88.22,28.65 v88.27,28.45 | 86.11,24.44 85.47,23.94 D21.12 | 86.11,24.44 86.13,23.64 D21.12 | 86.06,27.48 86.13,28.28 D21.11 | 86.06,27.48 85.45,28.02 D21.11 | 86.62,28.45 85.86,28.71 D21.11 | 86.62,28.45 85.96,27.99 D21.11 | 85.72,29.22 85.36,28.5 D21.11 | 85.72,29.22 86.09,28.5 D21.11 | 89.28,22.76 89.83,23.34 D21.13 89.14,23.55 89.28,22.76 | 89.28,19.79 89.14,19 D21.14 | 89.28,19.79 89.83,19.2 D21.14
  Bottom 0.813: D21.11 85.72,28.7 | D21.13 89.53,23.5
DIG_9  (via drill 0.51)
  Top 0.61: 98.2,29.44 97.79,29.84 D22.28 | 98.2,29.44 98.42,29.21 v98.42,28.45 | 98.2,29.44 98.22,28.44 v98.42,28.45 | 98.2,29.44 98.61,28.53 v98.42,28.45
  Top 0.813: 98.8,18.92 98.17,18.92 97.79,18.54 D22.23 | D22.13 98.8,23.62 | 98.8,23.62 96.78,23.62 | 96.78,23.62 D22.12 | D22.14 98.8,18.92 | 96.78,23.62 95.99,23.91 D22.12 | 96.78,23.62 95.99,23.34 D22.12 | 98.8,23.62 99.59,23.34 D22.13 | 98.8,23.62 99.59,23.91 D22.13 | 98.8,18.92 99.59,18.64 D22.14 | 98.8,18.92 99.59,19.21 D22.14
  Bottom 0.61: D22.11 95.89,27.81 96.22,27.48 | 96.22,27.48 96.27,27.43 96.27,24.44 | 96.27,24.44 96.27,24 D22.12 | v98.42,28.45 97.41,28.45 | 97.41,28.45 96.78,28.45 | 96.78,28.45 96.14,28.45 95.89,28.7 | 95.89,30.48 95.89,29.22 | 95.89,29.22 D22.11 | 99.69,23.5 99.44,23.24 99.44,22.76 | 99.44,22.76 99.44,19.79 | 99.44,19.79 99.44,19.18 D22.14 | 97.41,28.45 98.38,28.25 v98.42,28.45 | 97.41,28.45 98.38,28.65 v98.42,28.45 | 96.27,24.44 95.63,23.94 D22.12 | 96.27,24.44 96.29,23.64 D22.12 | 96.22,27.48 96.29,28.28 D22.11 | 96.22,27.48 95.61,28.02 D22.11 | 96.78,28.45 96.02,28.71 D22.11 | 96.78,28.45 96.12,27.99 D22.11 | 95.89,29.22 95.52,28.5 D22.11 | 95.89,29.22 96.25,28.5 D22.11 | 99.44,22.76 99.99,23.34 D22.13 99.3,23.55 99.44,22.76 | 99.44,19.79 99.3,19 D22.14 | 99.44,19.79 99.99,19.2 D22.14
  Bottom 0.813: D22.11 95.89,28.7 | 95.89,30.48 R14.1 | D22.13 99.69,23.5
DIG_10  (via drill 0.51)
  Top 0.61: 108.36,29.44 107.95,29.84 D23.28 | 108.36,29.44 108.58,29.21 v108.58,28.45 | 108.36,29.44 108.38,28.44 v108.58,28.45 | 108.36,29.44 108.77,28.53 v108.58,28.45
  Top 0.813: D23.13 108.95,23.62 | 108.95,23.62 106.94,23.62 | 106.94,23.62 D23.12 | D23.23 107.95,18.54 108.33,18.92 108.95,18.92 | D23.14 108.95,18.92 | 106.94,23.62 106.15,23.91 D23.12 | 106.94,23.62 106.15,23.34 D23.12 | 108.95,23.62 109.75,23.34 D23.13 | 108.95,23.62 109.75,23.91 D23.13 | 108.95,18.92 109.75,18.64 D23.14 | 108.95,18.92 109.75,19.21 D23.14
  Bottom 0.61: 109.86,23.5 109.6,23.24 109.6,22.76 | 109.6,22.76 109.6,19.79 | 109.6,19.79 109.6,19.18 D23.14 | D23.11 106.05,27.81 106.38,27.48 | 106.38,27.48 106.43,27.43 106.43,24.44 | 106.43,24.44 106.43,24 D23.12 | v108.58,28.45 107.57,28.45 | 107.57,28.45 106.94,28.45 | 106.94,28.45 106.3,28.45 106.05,28.7 | 106.05,29.22 R15.1 | 106.05,29.22 D23.11 | 107.57,28.45 108.54,28.25 v108.58,28.45 | 107.57,28.45 108.54,28.65 v108.58,28.45 | 106.43,24.44 105.79,23.94 D23.12 | 106.43,24.44 106.45,23.64 D23.12 | 106.38,27.48 106.45,28.28 D23.11 | 106.38,27.48 105.78,28.02 D23.11 | 106.94,28.45 106.18,28.71 D23.11 | 106.94,28.45 106.28,27.99 D23.11 | 106.05,29.22 105.68,28.5 D23.11 | 106.05,29.22 106.41,28.5 D23.11 | 109.6,22.76 110.15,23.34 D23.13 109.45,23.55 109.6,22.76 | 109.6,19.79 109.45,19 D23.14 | 109.6,19.79 110.15,19.2 D23.14
  Bottom 0.813: D23.13 109.86,23.5 | D23.11 106.05,28.7
DIG_11  (via drill 0.51)
  Top 0.61: 118.52,29.44 118.11,29.84 D24.28 | 118.52,29.44 118.75,29.21 v118.75,28.45 | 118.52,29.44 118.54,28.44 v118.75,28.45 | 118.52,29.44 118.93,28.53 v118.75,28.45
  Top 0.813: D24.13 119.11,23.62 | 119.11,23.62 117.11,23.62 | 117.11,23.62 D24.12 | D24.23 118.11,18.29 118.62,18.8 119.12,18.8 | 119.12,18.8 119.89,18.8 D24.14 | 117.11,23.62 116.31,23.91 D24.12 | 117.11,23.62 116.31,23.34 D24.12 | 119.11,23.62 119.91,23.34 D24.13 | 119.11,23.62 119.91,23.91 D24.13 | 119.12,18.8 119.95,18.62 D24.14 | 119.12,18.8 119.87,19.19 D24.14
  Bottom 0.61: D24.11 116.2,27.81 116.53,27.48 | 116.53,27.48 116.59,27.43 116.59,24.44 | 116.59,24.44 116.59,24 D24.12 | 116.2,28.7 116.46,28.45 117.1,28.45 | 116.2,29.22 R16.1 | 116.2,29.22 D24.11 | 120.02,23.5 119.76,23.24 119.76,22.76 | 119.76,22.76 119.76,19.79 | 119.76,19.79 119.76,19.18 D24.14 | v118.75,28.45 117.73,28.45 | 117.73,28.45 117.1,28.45 | 117.73,28.45 118.7,28.25 v118.75,28.45 | 117.73,28.45 118.7,28.65 v118.75,28.45 | 116.59,24.44 115.95,23.94 D24.12 | 116.59,24.44 116.61,23.64 D24.12 | 116.53,27.48 116.61,28.28 D24.11 | 116.53,27.48 115.94,28.02 D24.11 | 116.2,29.22 115.84,28.5 D24.11 | 116.2,29.22 116.57,28.5 D24.11 | 117.1,28.45 116.34,28.71 D24.11 | 117.1,28.45 116.44,27.99 D24.11 | 119.76,22.76 120.31,23.34 D24.13 119.61,23.55 119.76,22.76 | 119.76,19.79 119.61,19 D24.14 | 119.76,19.79 120.31,19.2 D24.14
  Bottom 0.813: D24.11 116.2,28.7 | D24.13 120.02,23.5
DIG_12  (via drill 0.51)
  Top 0.406: 128.27,29.84 D25.28
  Top 0.61: 128.27,29.84 128.68,29.44 | 128.68,29.44 128.91,29.21 v128.91,28.45 | 128.68,29.44 128.7,28.44 v128.91,28.45 | 128.68,29.44 129.09,28.53 v128.91,28.45
  Top 0.813: D25.13 129.28,23.62 | 129.28,23.62 127.27,23.62 | 127.27,23.62 D25.12 | D25.23 128.27,18.03 129.03,18.8 129.28,18.8 | 129.28,18.8 130.05,18.8 D25.14 | 127.27,23.62 126.47,23.91 D25.12 | 127.27,23.62 126.47,23.34 D25.12 | 129.28,23.62 130.07,23.34 D25.13 | 129.28,23.62 130.07,23.91 D25.13 | 129.28,18.8 130.11,18.62 D25.14 | 129.28,18.8 130.03,19.19 D25.14
  Bottom 0.61: 130.18,23.5 129.92,23.24 129.92,22.76 | 129.92,22.76 129.92,19.79 | 129.92,19.79 129.92,19.18 D25.14 | D25.11 126.36,27.81 126.69,27.48 | 126.69,27.48 126.75,27.43 126.75,24.44 | 126.75,24.44 126.75,24 D25.12 | v128.91,28.45 127.89,28.45 | 127.89,28.45 127.26,28.45 | 127.26,28.45 126.62,28.45 126.36,28.7 | 126.36,29.22 R17.1 | 126.36,29.22 D25.11 | 127.89,28.45 128.86,28.25 v128.91,28.45 | 127.89,28.45 128.86,28.65 v128.91,28.45 | 126.75,24.44 126.11,23.94 D25.12 | 126.75,24.44 126.77,23.64 D25.12 | 126.69,27.48 126.77,28.28 D25.11 | 126.69,27.48 126.09,28.02 D25.11 | 127.26,28.45 126.5,28.71 D25.11 | 127.26,28.45 126.6,27.99 D25.11 | 126.36,29.22 126,28.5 D25.11 | 126.36,29.22 126.73,28.5 D25.11 | 129.92,22.76 130.47,23.34 D25.13 129.78,23.55 129.92,22.76 | 129.92,19.79 129.78,19 D25.14 | 129.92,19.79 130.47,19.2 D25.14
  Bottom 0.813: D25.13 130.18,23.5 | D25.11 126.36,28.7
DIG_13  (via drill 0.51)
  Top 0.406: v139.06,28.45 139.06,29.46 | 139.06,29.46 139.06,30.49 D26.28 | 139.06,29.46 138.77,28.54 v139.06,28.45 | 139.06,29.46 139.36,28.54 v139.06,28.45
  Top 0.61: 138.84,29.44 138.43,29.84 D26.28 | 138.84,29.44 139.06,29.21 | 138.84,29.44 138.86,28.44 v139.06,28.45 139.25,28.53 138.84,29.44
  Top 0.813: D26.13 139.44,23.62 | 139.44,23.62 137.43,23.62 | 137.43,23.62 D26.12 | D26.14 139.44,18.92 | 139.44,18.92 138.81,18.92 138.43,18.54 D26.23 | 137.43,23.62 136.63,23.91 D26.12 | 137.43,23.62 136.63,23.34 D26.12 | 139.44,23.62 140.23,23.34 D26.13 | 139.44,23.62 140.23,23.91 D26.13 | 139.44,18.92 140.23,18.64 D26.14 | 139.44,18.92 140.23,19.21 D26.14
  Bottom 0.61: D26.11 136.53,27.81 136.85,27.48 | 136.85,27.48 136.91,27.43 136.91,24.44 | 136.91,24.44 136.91,24 D26.12 | v139.06,28.45 138.05,28.45 | 138.05,28.45 137.42,28.45 | 137.42,28.45 136.78,28.45 136.53,28.7 | 136.53,29.22 R18.1 | 136.53,29.22 D26.11 | 140.34,23.5 140.08,23.24 140.08,22.76 | 140.08,22.76 140.08,19.79 | 140.08,19.79 140.08,19.18 D26.14 | 138.05,28.45 139.02,28.25 v139.06,28.45 | 138.05,28.45 139.02,28.65 v139.06,28.45 | 136.91,24.44 136.27,23.94 D26.12 | 136.91,24.44 136.93,23.64 D26.12 | 136.85,27.48 136.93,28.28 D26.11 | 136.85,27.48 136.25,28.02 D26.11 | 137.42,28.45 136.66,28.71 D26.11 | 137.42,28.45 136.76,27.99 D26.11 | 136.53,29.22 136.16,28.5 D26.11 | 136.53,29.22 136.89,28.5 D26.11 | 140.08,22.76 140.63,23.34 D26.13 139.94,23.55 140.08,22.76 | 140.08,19.79 139.94,19 D26.14 | 140.08,19.79 140.63,19.2 D26.14
  Bottom 0.813: D26.11 136.53,28.7 | D26.13 140.34,23.5
DIG_14  (via drill 0.51)
  Top 0.61: 149,29.44 148.59,29.84 D27.28 | 149,29.44 149.22,29.21 v149.22,28.45 | 149,29.44 149.02,28.44 v149.22,28.45 | 149,29.44 149.41,28.53 v149.22,28.45
  Top 0.813: D27.13 149.59,23.62 | 149.59,23.62 147.59,23.62 | 147.59,23.62 D27.12 | D27.23 148.59,18.29 149.1,18.8 149.6,18.8 | 149.6,18.8 150.37,18.8 D27.14 | D27.14 149.59,18.92 | 149.59,18.92 149.48,18.92 | 147.59,23.62 146.79,23.91 D27.12 | 147.59,23.62 146.79,23.34 D27.12 | 149.59,23.62 150.39,23.34 D27.13 | 149.59,23.62 150.39,23.91 D27.13 | 149.6,18.8 150.43,18.62 D27.14 | 149.6,18.8 150.35,19.19 D27.14 | 149.59,18.92 150.39,18.64 D27.14 | 149.59,18.92 150.39,19.21 D27.14
  Bottom 0.61: D27.11 146.69,27.81 147.01,27.48 | 147.01,27.48 147.07,27.43 147.07,24.44 | D27.12 147.07,24 147.07,24.44 | v149.22,28.45 148.21,28.45 | 148.21,28.45 147.58,28.45 | 147.58,28.45 146.94,28.45 146.69,28.7 | 146.69,29.22 R19.1 | 146.69,29.22 D27.11 | 150.5,23.5 150.24,23.24 150.24,22.76 | 150.24,22.76 150.24,19.79 | 150.24,19.79 150.24,19.18 D27.14 | 148.21,28.45 149.18,28.25 v149.22,28.45 | 148.21,28.45 149.18,28.65 v149.22,28.45 | 147.07,24.44 146.43,23.94 D27.12 | 147.07,24.44 147.09,23.64 D27.12 | 147.01,27.48 147.09,28.28 D27.11 | 147.01,27.48 146.41,28.02 D27.11 | 147.58,28.45 146.82,28.71 D27.11 | 147.58,28.45 146.92,27.99 D27.11 | 146.69,29.22 146.32,28.5 D27.11 | 146.69,29.22 147.05,28.5 D27.11 | 150.24,22.76 150.79,23.34 D27.13 150.09,23.55 150.24,22.76 | 150.24,19.79 150.09,19 D27.14 | 150.24,19.79 150.79,19.2 D27.14
  Bottom 0.813: D27.11 146.69,28.7 | D27.13 150.5,23.5
IO-A  (via drill 0.51)
  Top 0.61: R29.2 R36.2 | v90.68,10.67 89.66,10.67 | 89.66,10.67 89.15,10.16 84.67,10.16 | 84.67,10.16 84.07,10.16 R29.2 | 89.66,10.67 90.64,10.47 v90.68,10.67 | 89.66,10.67 90.64,10.87 v90.68,10.67 | 84.67,10.16 83.85,10.96 R29.2 | 84.67,10.16 83.53,10.26 R29.2
  Bottom 0.406: 114.05,11.3 114.43,11.3 115.57,11.94 116.46,11.43 116.84,10.54
  Bottom 0.61: M4.1 81.97,10.19 82.35,10.57 | 82.35,10.57 R36.2 R29.2 | v90.68,10.67 91.69,10.67 | 91.69,10.67 113.41,10.67 114.05,11.3 | 116.84,10.54 116.84,9.91 117.35,9.4 119.38,9.4 119.79,9.81 | 119.79,9.81 X4.6 | 91.69,10.67 90.72,10.87 v90.68,10.67 | 91.69,10.67 90.72,10.47 v90.68,10.67 | 82.35,10.57 83.46,10.28 R29.2 | 82.35,10.57 83.4,11.04 R29.2 | 119.79,9.81 120.83,10.3 X4.6 | 119.79,9.81 120.28,10.84 X4.6
IO-B
  Top 0.61: R37.2 R30.2
  Bottom 0.61: M5.1 88.32,12.85 88.7,13.24 | 88.7,13.24 R37.2 R30.2 | R30.2 91.06,13.34 91.13,13.41 | 91.13,13.41 93.47,15.75 96.65,15.75 96.77,15.62 98.68,15.62 99.44,15.37 100.2,15.37 100.84,15.62 104.27,15.62 105.16,14.73 107.95,14.73 108.08,14.61 110.87,14.61 114.17,15.49 117.22,15.49 118.78,13.83 | 118.78,13.83 118.87,13.72 X4.5 | 88.7,13.24 89.81,12.94 R30.2 | 88.7,13.24 89.75,13.71 R30.2 | 91.13,13.41 90.03,13.73 R30.2 | 91.13,13.41 90.07,12.96 R30.2 | 118.78,13.83 119.01,13.04 X4.5 | 118.78,13.83 119.56,13.57 X4.5
IO-C
  Top 0.61: R42.2 97.56,13.31 R54.2
  Bottom 0.406: 113.28,12.06 114.55,12.06 115.57,12.7 117.35,11.56
  Bottom 0.61: M6.1 96.46,12.87 96.83,13.24 | 96.83,13.24 R42.2 R54.2 | R54.2 98.04,12.83 98.61,12.26 | 98.61,12.26 99.31,11.56 112.27,11.56 112.78,12.06 113.28,12.06 | 117.31,11.59 117.35,11.56 117.73,11.18 117.73,10.79 X4.4 | 96.83,13.24 97.94,12.94 R54.2 | 96.83,13.24 97.88,13.71 R54.2 | 98.61,12.26 98.45,13.39 R54.2 | 98.61,12.26 97.77,13.04 R54.2 | 117.31,11.59 117.73,10.52 X4.4 | 117.31,11.59 118.31,11.02 X4.4
IO-D  (via drill 0.51 pad 0.25)
  Top 0.61: X4.3 117.7,12.35 | 117.7,12.35 118.11,11.94 118.62,11.94 119.38,11.18 119.38,10.03 120.14,9.27 125.36,9.27 | 125.36,9.27 126.24,9.27 v126.36,9.14 | R38.2 137.41,11.3 138.24,12.13 | 138.24,12.13 138.3,12.19 138.3,13.21 R55.2 | 125.36,9.27 126.3,8.95 v126.36,9.14 | 125.36,9.27 126.35,9.35 v126.36,9.14 | 138.24,12.13 138.79,13.14 R55.2 | 138.24,12.13 138.03,13.26 R55.2 | 117.7,12.35 117.21,13.38 X4.3 | 117.7,12.35 116.67,12.84 X4.3
  Bottom 0.61: 127.38,9.14 135.13,9.14 136.14,10.16 136.14,11.1 136.19,11.3 M7.1 137.41,11.18 138.3,12.06 138.3,12.12 | 127.38,9.14 v126.36,9.14 | 138.3,12.12 138.3,13.21 R55.2 | 127.38,9.14 126.41,9.34 v126.36,9.14 | 127.38,9.14 126.41,8.95 v126.36,9.14 | 138.3,12.12 138.8,13.16 R55.2 | 138.3,12.12 138.03,13.24 R55.2
IO-DP  (via drill 0.51, 0.51 pad 0.25)
  Top 0.61: R41.2 R59.2 | v62.36,11.18 63.37,11.18 | 63.37,11.18 63.63,11.18 64.14,10.67 70.16,10.67 | 70.16,10.67 R59.2 | v47.37,13.72 48.39,13.72 | 48.39,13.72 50.04,13.72 50.46,13.29 | 50.46,13.29 v51.18,12.57 | 63.37,11.18 62.4,11.38 v62.36,11.18 | 63.37,11.18 62.4,10.98 v62.36,11.18 | 48.39,13.72 47.41,13.91 v47.37,13.72 | 48.39,13.72 47.41,13.52 v47.37,13.72 | 50.46,13.29 51.01,12.46 v51.18,12.57 | 50.46,13.29 51.29,12.74 v51.18,12.57 | 70.16,10.67 71.24,10.29 R59.2 | 70.16,10.67 71.24,11.05 R59.2
  Bottom 0.61: R59.2 71.83,10.67 | v62.36,11.18 62.1,10.92 61.37,10.92 | 61.37,10.92 52.83,10.92 51.9,11.86 | 51.9,11.86 v51.18,12.57 | v47.37,13.72 46.65,14.43 | 46.65,14.43 45.72,15.37 43.43,15.37 42.55,14.48 35.56,14.48 35.15,14.07 | M11.1 72.96,11.14 72.59,10.77 | 72.59,10.77 R41.2 R59.2 | 35.15,14.07 X2.9 | 61.37,10.92 62.37,10.97 v62.36,11.18 | 61.37,10.92 62.27,11.36 v62.36,11.18 | 46.65,14.43 47.2,13.6 v47.37,13.72 | 46.65,14.43 47.48,13.89 v47.37,13.72 | 51.9,11.86 51.35,12.69 v51.18,12.57 | 51.9,11.86 51.07,12.4 v51.18,12.57 | 72.59,10.77 71.48,11.06 R59.2 | 72.59,10.77 71.54,10.3 R59.2 | 35.15,14.07 34.12,13.57 X2.9 | 35.15,14.07 34.66,13.03 X2.9
IO-E  (via drill 0.4)
  Top 0.406: 24,10.92 24.38,11.56
  Top 0.61: R56.2 R43.2 | 23.31,9.87 23.75,10.41 24.38,11.56 25.02,11.94 28.96,11.94 v29.21,11.68 | 23.31,9.87 23.24,9.78 R56.2 | 23.31,9.87 22.2,10.17 R56.2 | 23.31,9.87 22.26,9.41 R56.2
  Bottom 0.406: 35.05,9.53 29.84,9.53
  Bottom 0.61: 20.88,9.78 R56.2 | v29.21,11.68 29.21,10.16 29.84,9.53 | 35.05,9.53 35.43,9.14 36.7,9.14 37.3,9.74 | 20.88,9.78 M8.1 | X2.12 38.23,10.67 37.3,9.74 | 20.88,9.78 21.96,9.4 R56.2 | 20.88,9.78 21.96,10.16 R56.2 | 37.3,9.74 38.3,10.31 X2.12 | 37.3,9.74 37.72,10.82 X2.12
IO-F
  Top 0.61: R57.2 R39.2 | 35.31,8.32 35.31,8.64 34.29,9.65 34.29,11.43 34.8,11.94 35.69,11.94 36.03,12.29 | 35.31,8.32 35.31,7.24 R57.2 | X2.11 36.83,13.08 36.03,12.29 | 35.31,8.32 34.81,7.29 R57.2 | 35.31,8.32 35.57,7.21 R57.2 | 36.03,12.29 37.03,12.86 X2.11 | 36.03,12.29 36.45,13.36 X2.11
  Bottom 0.61: M9.1 34.04,5.97 34.32,6.25 | 34.32,6.25 R57.2 | 34.32,6.25 35.35,6.75 R57.2 | 34.32,6.25 34.81,7.29 R57.2
IO-G
  Top 0.61: R40.2 R58.2
  Bottom 0.305: 37.08,11.43 38.1,11.94 39.37,11.3 41.15,12.06
  Bottom 0.406: R58.2 63.5,12.45 63.11,12.84 | 62.48,14.1 62.48,13.46 63.11,12.84 | 36.32,10.67 36.71,11.06 | 36.71,11.06 37.08,11.43 | 41.15,12.06 41.27,11.94 | 63.11,12.84 63.91,12.08 R58.2 | 63.11,12.84 64.21,12.95 R58.2 | 36.71,11.06 35.61,11.17 X2.10 35.91,10.3 36.71,11.06
  Bottom 0.61: 62.48,14.1 61.34,15.24 56.9,15.24 56.01,14.35 51.44,14.35 48.01,10.92 42.8,10.92 41.78,11.94 41.27,11.94 | M10.1 65.86,12.93 65.48,12.54 | 65.48,12.54 R40.2 R58.2 | X2.10 36.32,10.67 | 65.48,12.54 64.37,12.84 R58.2 | 65.48,12.54 64.43,12.07 R58.2
NC1
  Bottom 2.184: BH4.P1 BH4.P4 | BH4.P3 BH4.P2
  Bottom 3.81: BH4.P1 BH4.P3
NC2
  Bottom 2.184: BH5.P1 BH5.P4 | BH5.P3 BH5.P2
  Bottom 3.81: BH5.P1 BH5.P3
NC3
  Bottom 2.184: BH6.M1 BH6.M4 | BH6.M2 BH6.M3
  Bottom 3.81: BH6.M4 BH6.M2
SEG_A
  Top 0.61: 49.02,30.97 D17.27 | 59.18,30.97 D18.27 | 69.34,30.97 D19.27 | 130.3,30.97 D25.27 | 140.46,30.97 D26.27 | D27.27 150.62,30.97 | 109.98,30.97 D23.27 | 99.82,30.97 D22.27 | D16.27 38.86,30.97 | D24.27 120.14,30.97
  Top 0.813: D2.10 9.26,28.32 | 9.26,28.32 9.14,28.32 8.38,29.08 8.38,30.97 D2.27 | 19.3,28.32 19.05,28.32 18.54,28.83 18.54,30.97 D14.27 | D14.10 19.42,28.32 | 19.42,28.32 19.3,28.32 | 19.3,28.32 18.54,29.08 | 151.38,28.32 151.13,28.32 150.62,28.83 150.62,30.97 | D27.10 151.5,28.32 | 151.5,28.32 151.38,28.32 | 151.38,28.32 150.62,29.08 | 49.02,30.97 49.02,28.83 49.53,28.32 49.78,28.32 | 29.46,28.32 29.21,28.32 28.7,28.83 28.7,30.97 D15.27 | 29.46,28.32 28.7,29.08 | D15.10 29.58,28.32 | 29.58,28.32 29.46,28.32 | 131.06,28.32 130.81,28.32 130.3,28.83 130.3,30.97 | D25.10 131.18,28.32 | 131.18,28.32 131.06,28.32 | 131.06,28.32 130.3,29.08 | 141.22,28.32 140.97,28.32 140.46,28.83 140.46,30.97 | D26.10 141.34,28.32 | 141.34,28.32 141.22,28.32 | 141.22,28.32 140.46,29.08 | 120.9,28.32 120.65,28.32 120.14,28.83 120.14,30.97 | D24.10 121.02,28.32 | 121.02,28.32 120.9,28.32 | 120.9,28.32 120.14,29.08 | 100.58,28.32 100.33,28.32 99.82,28.83 99.82,30.97 | D22.10 100.7,28.32 | 100.7,28.32 100.58,28.32 | 100.58,28.32 99.82,29.08 | 110.86,28.32 110.74,28.32 | 110.74,28.32 109.98,29.08 | 109.98,30.97 109.98,28.83 110.49,28.32 110.74,28.32 | D23.10 110.86,28.32 | 80.26,28.32 80.01,28.32 79.5,28.83 79.5,30.97 D20.27 | D20.10 80.38,28.32 | 80.38,28.32 80.26,28.32 | 80.26,28.32 79.5,29.08 | 90.54,28.32 90.42,28.32 | 90.42,28.32 89.66,29.08 | 59.94,28.32 59.69,28.32 59.18,28.83 59.18,30.97 | D18.10 60.06,28.32 | 60.06,28.32 59.94,28.32 | 59.94,28.32 59.18,29.08 | 70.1,28.32 69.85,28.32 69.34,28.83 69.34,30.97 | D19.10 70.22,28.32 | 70.22,28.32 70.1,28.32 | 70.1,28.32 69.34,29.08 | 39.62,28.32 39.37,28.32 38.86,28.83 38.86,30.97 | D16.10 39.74,28.32 | 39.74,28.32 39.62,28.32
  Top 0.813: 39.62,28.32 38.86,29.08 | 49.9,28.32 49.78,28.32 | 49.78,28.32 49.02,29.08 | D17.10 49.9,28.32 | D21.10 90.54,28.32 | 90.42,28.32 90.17,28.32 89.66,28.83 89.66,30.97 D21.27 | 9.26,28.32 10.06,28.03 D2.10 | 9.26,28.32 10.06,28.61 D2.10 | 19.42,28.32 20.22,28.03 D14.10 | 19.42,28.32 20.22,28.61 D14.10 | 29.58,28.32 30.38,28.03 D15.10 | 29.58,28.32 30.38,28.61 D15.10 | 39.74,28.32 40.54,28.03 D16.10 | 39.74,28.32 40.54,28.61 D16.10 | 49.9,28.32 50.7,28.03 D17.10 | 49.9,28.32 50.7,28.61 D17.10 | 60.06,28.32 60.86,28.03 D18.10 | 60.06,28.32 60.86,28.61 D18.10 | 70.22,28.32 71.02,28.03 D19.10 | 70.22,28.32 71.02,28.61 D19.10 | 80.38,28.32 81.18,28.03 D20.10 | 80.38,28.32 81.18,28.61 D20.10 | 90.54,28.32 91.34,28.03 D21.10 | 90.54,28.32 91.34,28.61 D21.10 | 100.7,28.32 101.5,28.03 D22.10 | 100.7,28.32 101.5,28.61 D22.10 | 110.86,28.32 111.66,28.03 D23.10 | 110.86,28.32 111.66,28.61 D23.10 | 121.02,28.32 121.82,28.03 D24.10 | 121.02,28.32 121.82,28.61 D24.10 | 131.18,28.32 131.98,28.03 D25.10 | 131.18,28.32 131.98,28.61 D25.10 | 141.34,28.32 142.14,28.03 D26.10 | 141.34,28.32 142.14,28.61 D26.10 | 151.5,28.32 152.3,28.03 D27.10 | 151.5,28.32 152.3,28.61 D27.10
  Bottom 0.406: 78.36,16.64 78.36,18.16 78.23,18.29 78.23,24.13 79.5,25.4
  Bottom 0.61: D2.10 10.16,29.22 | 10.16,29.22 10.16,29.72 13.21,32.77 18.92,32.77 20.32,31.37 20.32,31.24 | D14.10 20.32,29.22 | 20.32,29.22 20.32,31.24 | 20.32,31.24 21.84,32.77 29.08,32.77 30.48,31.37 30.48,31.24 | D27.10 152.4,29.22 | 152.4,29.22 152.4,31.37 151,32.77 143.76,32.77 142.24,31.24 | 142.24,31.24 142.24,31.37 140.84,32.77 133.6,32.77 132.08,31.24 | D26.10 142.24,29.22 | 142.24,29.22 142.24,31.24 | 121.92,31.24 121.92,31.37 120.52,32.77 113.28,32.77 111.76,31.24 | D24.10 121.92,29.22 | 121.92,29.22 121.92,31.24 | 121.92,31.24 123.44,32.77 130.68,32.77 132.08,31.37 132.08,31.24 | 111.76,31.24 111.76,31.37 110.36,32.77 103.12,32.77 101.6,31.24 | D23.10 111.76,29.22 | 111.76,29.22 111.76,31.24 | 101.6,31.24 101.6,31.37 100.2,32.77 92.96,32.77 91.44,31.24 | D22.10 101.6,29.22 | 101.6,29.22 101.6,31.24 | 91.44,31.24 91.44,31.37 90.04,32.77 82.8,32.77 81.28,31.24 | D21.10 91.44,29.22 | 91.44,29.22 91.44,31.24 | 71.12,31.24 71.12,31.37 69.72,32.77 62.48,32.77 60.96,31.24 | D19.10 71.12,29.22 | 71.12,29.22 71.12,31.24 | 71.12,31.24 72.64,32.77 79.88,32.77 81.28,31.37 81.28,31.24 | 60.96,31.24 60.96,31.37 59.56,32.77 52.32,32.77 50.8,31.24 | D18.10 60.96,29.22 | 60.96,29.22 60.96,31.24 | 50.8,31.24 50.8,31.37 49.4,32.77 42.16,32.77 40.64,31.24 | D17.10 50.8,29.22 | 50.8,29.22 50.8,31.24 | 40.64,31.24 40.64,31.37 39.24,32.77 32,32.77 30.48,31.24 | D16.10 40.64,29.22 | 40.64,29.22 40.64,31.24 | D15.10 30.48,29.22 | 30.48,29.22 30.48,31.24 | D25.10 132.08,29.22 | 132.08,29.22 132.08,31.24 | D20.10 81.28,29.22 | 81.28,29.22 81.28,31.24 | 78.36,16.64 81.05,13.95 81.05,11.71 M4.3 | 79.5,25.4 79.5,26.54 80.64,27.68 | 80.64,27.68 D20.10